# Altium project mcp_amp.PrjPCB
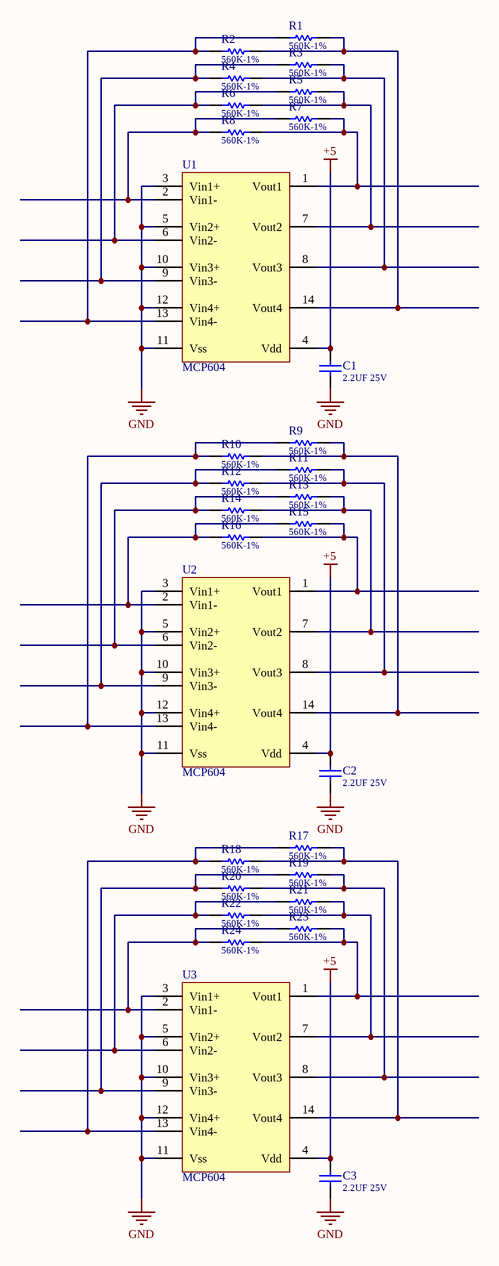
[diagram p0: sch.SchDoc]
1 sheet, 30 parts. Net scope: global (net labels, ports and power ports of the same name join across sheets).
Board file: pcb.PcbDoc

## Sheet sch.SchDoc
size A4 portrait

### Parts
C1  2.2UF 25V  [RC_0603]
C2  2.2UF 25V  [RC_0603]
C3  2.2UF 25V  [RC_0603]
R1  560K-1%  [RR_0603]
R2  560K-1%  [RR_0603]
R3  560K-1%  [RR_0603]
R4  560K-1%  [RR_0603]
R5  560K-1%  [RR_0603]
R6  560K-1%  [RR_0603]
R7  560K-1%  [RR_0603]
R8  560K-1%  [RR_0603]
R9  560K-1%  [RR_0603]
R10  560K-1%  [RR_0603]
R11  560K-1%  [RR_0603]
R12  560K-1%  [RR_0603]
R13  560K-1%  [RR_0603]
R14  560K-1%  [RR_0603]
R15  560K-1%  [RR_0603]
R16  560K-1%  [RR_0603]
R17  560K-1%  [RR_0603]
R18  560K-1%  [RR_0603]
R19  560K-1%  [RR_0603]
R20  560K-1%  [RR_0603]
R21  560K-1%  [RR_0603]
R22  560K-1%  [RR_0603]
R23  560K-1%  [RR_0603]
R24  560K-1%  [RR_0603]
U1  MCP604  [RR_SO14]
U2  MCP604  [RR_SO14]
U3  MCP604  [RR_SO14]

### Nets
+5: C1.2 C2.2 C3.2 U1.4(Vdd) U2.4(Vdd) U3.4(Vdd)
GND: C1.1 C2.1 C3.1 U1.3(Vin1+) U1.5(Vin2+) U1.10(Vin3+) U1.11(Vss) U1.12(Vin4+) U2.3(Vin1+) U2.5(Vin2+) U2.10(Vin3+) U2.11(Vss) U2.12(Vin4+) U3.3(Vin1+) U3.5(Vin2+) U3.10(Vin3+) U3.11(Vss) U3.12(Vin4+)
NetR1_1: R1.1 R2.1 U1.14(Vout4)
NetR1_2: R1.2 R2.2 U1.13(Vin4-)
NetR3_1: R3.1 R4.1 U1.8(Vout3)
NetR3_2: R3.2 R4.2 U1.9(Vin3-)
NetR5_1: R5.1 R6.1 U1.7(Vout2)
NetR5_2: R5.2 R6.2 U1.6(Vin2-)
NetR7_1: R7.1 R8.1 U1.1(Vout1)
NetR7_2: R7.2 R8.2 U1.2(Vin1-)
NetR9_1: R9.1 R10.1 U2.14(Vout4)
NetR9_2: R9.2 R10.2 U2.13(Vin4-)
NetR11_1: R11.1 R12.1 U2.8(Vout3)
NetR11_2: R11.2 R12.2 U2.9(Vin3-)
NetR13_1: R13.1 R14.1 U2.7(Vout2)
NetR13_2: R13.2 R14.2 U2.6(Vin2-)
NetR15_1: R15.1 R16.1 U2.1(Vout1)
NetR15_2: R15.2 R16.2 U2.2(Vin1-)
NetR17_1: R17.1 R18.1 U3.14(Vout4)
NetR17_2: R17.2 R18.2 U3.13(Vin4-)
NetR19_1: R19.1 R20.1 U3.8(Vout3)
NetR19_2: R19.2 R20.2 U3.9(Vin3-)
NetR21_1: R21.1 R22.1 U3.7(Vout2)
NetR21_2: R21.2 R22.2 U3.6(Vin2-)
NetR23_1: R23.1 R24.1 U3.1(Vout1)
NetR23_2: R23.2 R24.2 U3.2(Vin1-)

### Notes on the sheet
- Title
- Size:
- Date:
- A4
- Number:
- Time:
- Revision:
- Sheet
- of
- File:

### Library data of the parts
C1-C3 = CAP_0603_2.2UF 25V: Manufacturer: Murata; Order number: GRM188R61E225KA12D; Value: CAP CER 2.2UF 25V X5R 0603; Part Number: CAP_0603_2.2UF 25V; Commentary: 2.2UF 25V; Package: 0603; Cost: 0,15
R1-R24 = RES: Manufacturer: Yageo; Order number: RC0603FR-07560KL; Value: RES SMD 560K OHM 1% 1/10W 0603; Commentary: 560K-1%; Package: 0603; Cost: 0,1